# EAGLE design DarkESC (EAGLE 9.0.0)

## Sheet 1 of 6
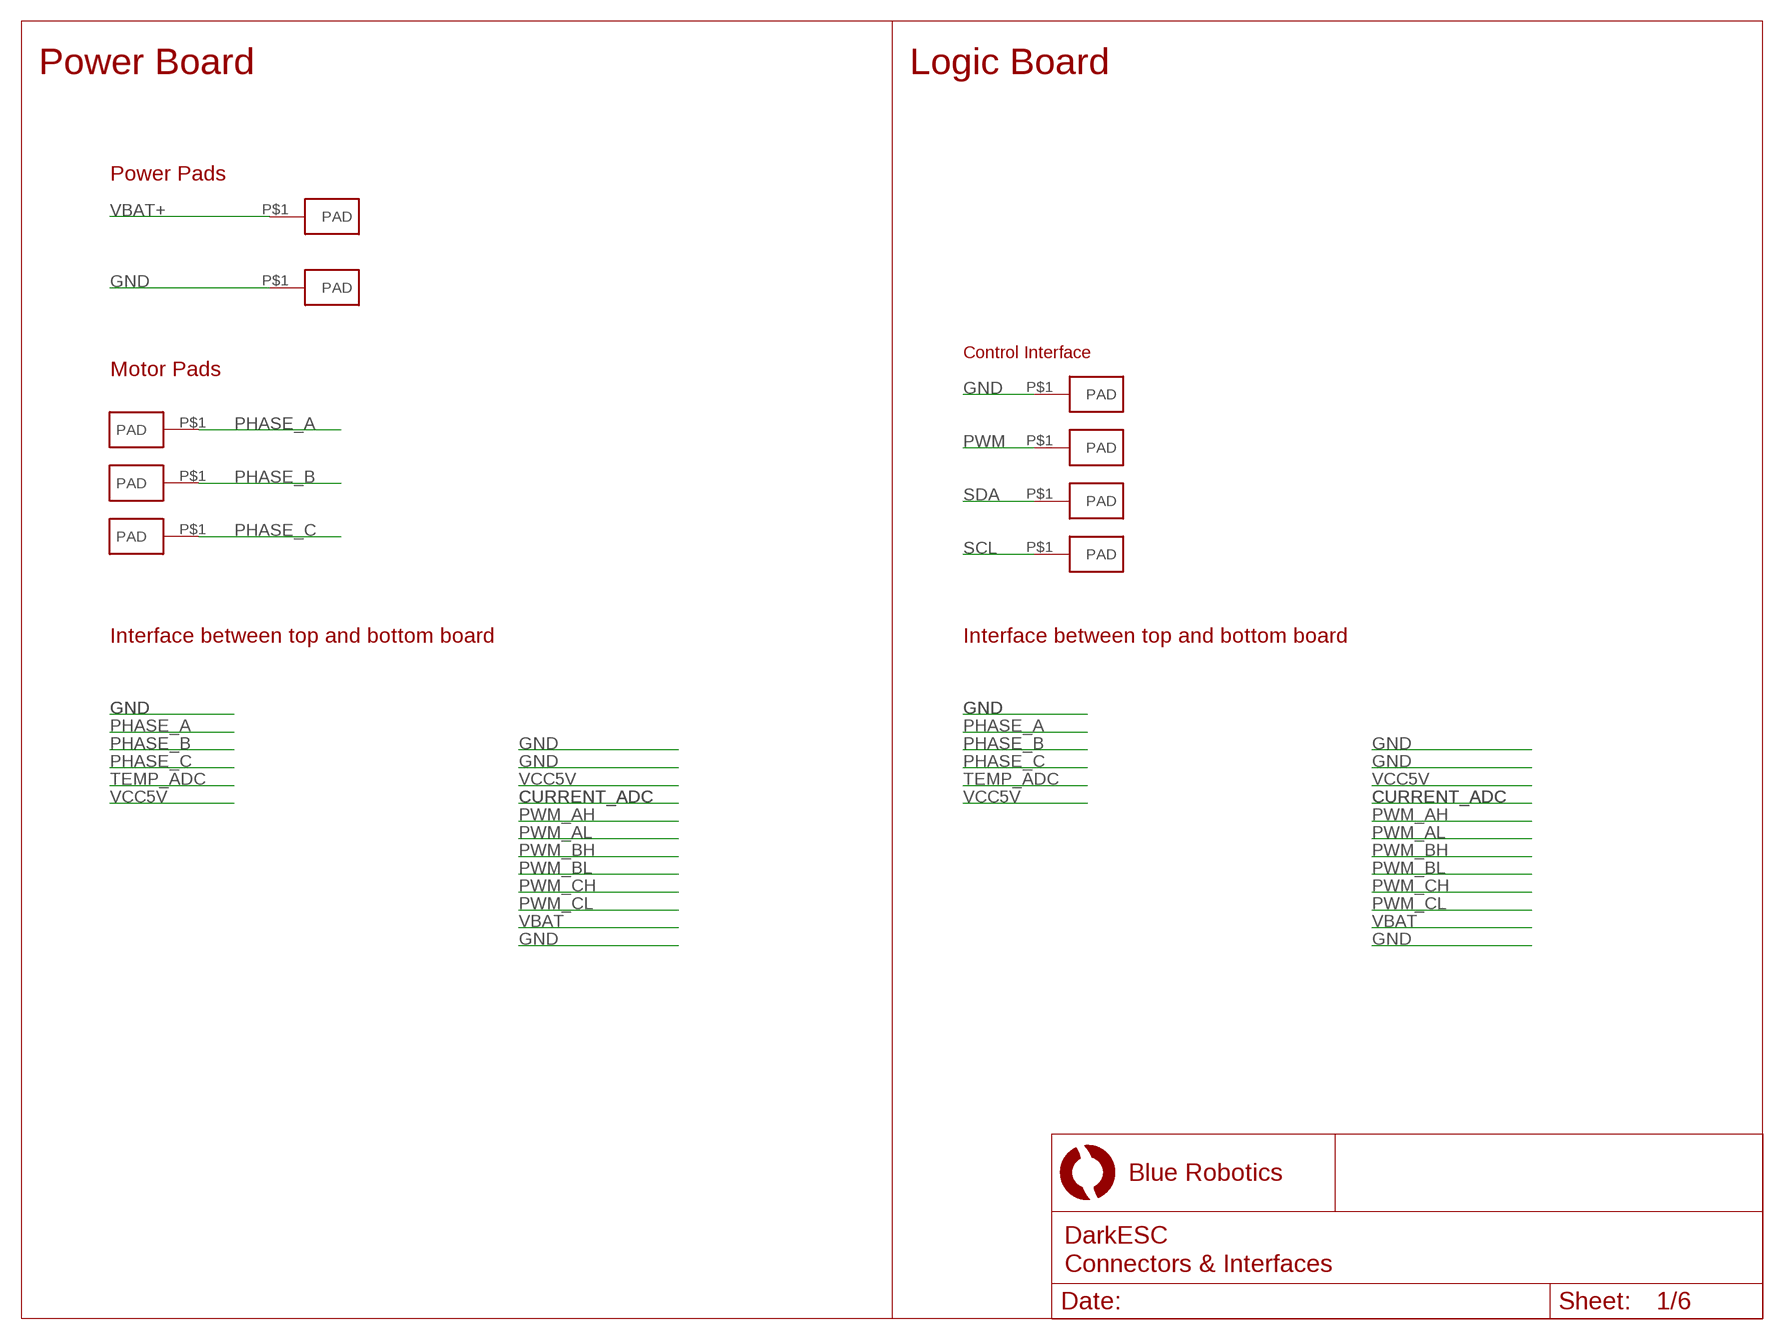
[diagram p0: schematic, sheet 1]

### Parts
U$1  PADPTH-MED  [PAD-PTH-MED-1]
U$2  PADPTH-MED  [PAD-PTH-MED-1]
U$5  PAD18AWG  [PAD-PTH-18AWG-1]
U$6  PAD18AWG  [PAD-PTH-18AWG-1]
U$7  PAD18AWG  [PAD-PTH-18AWG-1]
U$11  PAD1.5X3MM  [PAD-1.5X3MM]
U$12  PAD1.5X3MM  [PAD-1.5X3MM]
U$13  PAD1.5X3MM  [PAD-1.5X3MM]
U$14  PAD1.5X3MM  [PAD-1.5X3MM]

### Nets
GND: U$2.P$1(PAD) U$11.P$1(PAD) ; also sheet 2,3,4,5,6
PHASE_A [HV]: U$5.P$1(PAD) ; also sheet 5,6
PHASE_B [HV]: U$6.P$1(PAD) ; also sheet 5,6
PHASE_C [HV]: U$7.P$1(PAD) ; also sheet 5,6
PWM: U$14.P$1(PAD) ; also sheet 2
SCL: U$13.P$1(PAD) ; also sheet 2
SDA: U$12.P$1(PAD) ; also sheet 2
VBAT+ [HV]: U$1.P$1(PAD) ; also sheet 3,4

### Notes on the sheet
- Power Board | Logic Board
- Power Pads
- Control Interface
- Motor Pads
- Interface between top and bottom board | Interface between top and bottom board

## Sheet 2 of 6
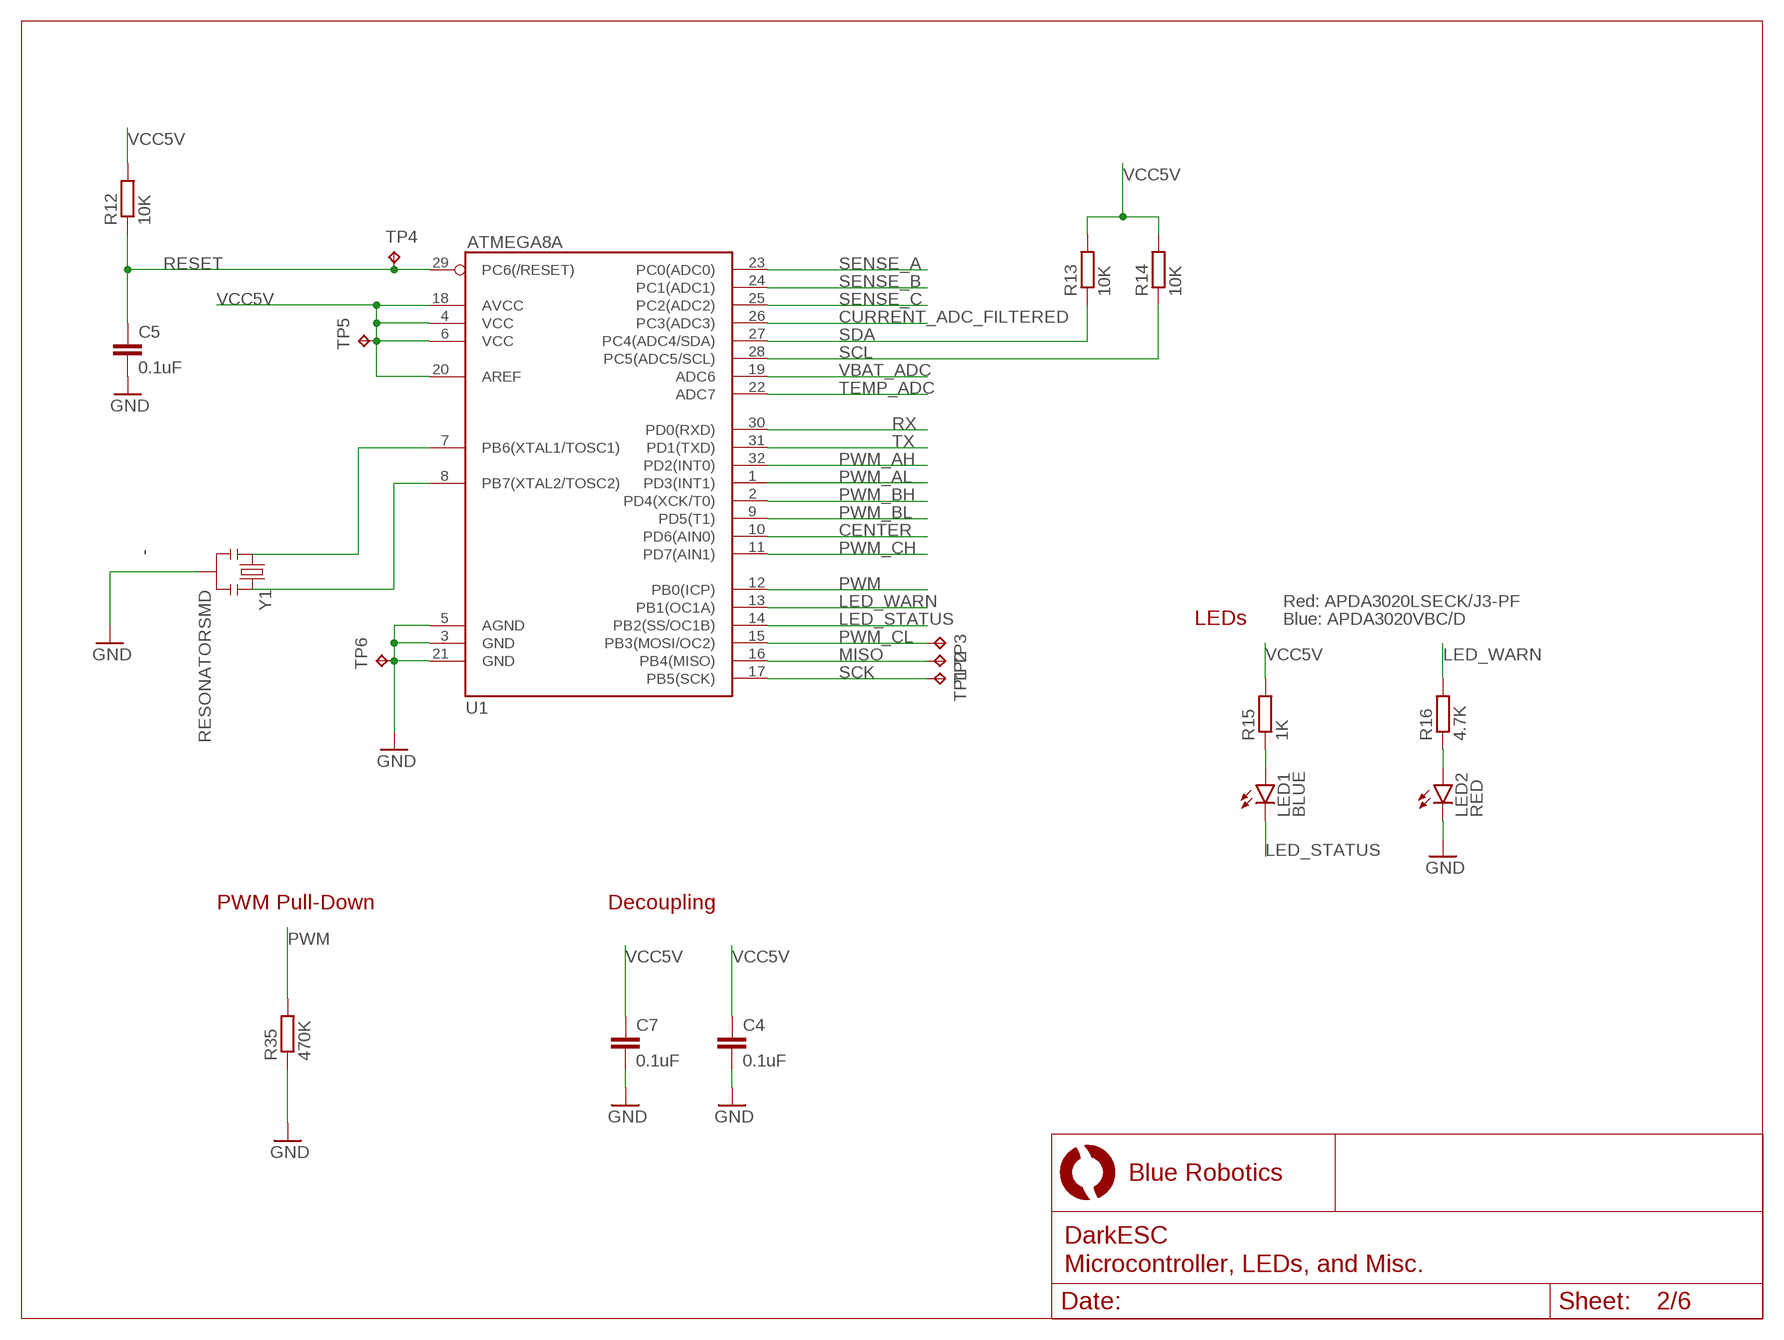
[diagram p1: schematic, sheet 2]

### Parts
C4  0.1uF  C-EUC3216  [C3216]
C5  0.1uF  C-EUC3216  [C3216]
C7  0.1uF  C-EUC3216  [C3216]
LED1  BLUE  LED3X2-RA  [SMT-LED-3X2-RA]
LED2  RED  LED3X2-RA  [SMT-LED-3X2-RA]
R12  10K  R-EU_R3216  [R3216]
R13  10K  R-EU_R3216  [R3216]
R14  10K  R-EU_R3216  [R3216]
R15  1K  R-EU_R3216  [R3216]
R16  4.7K  R-EU_R3216  [R3216]
R35  470K  R-EU_R3216  [R3216]
TP1  TPB1,27  [B1,27]
TP2  TPB1,27  [B1,27]
TP3  TPB1,27  [B1,27]
TP4  TPB1,27  [B1,27]
TP5  TPB1,27  [B1,27]
TP6  TPB1,27  [B1,27]
U1  ATMEGA168  [TQFP32-08]
Y1  RESONATORSMD  [RESONATOR-SMD]

### Nets
CENTER: U1.10(PD6(AIN0)) ; also sheet 5
CURRENT_ADC_FILTERED: U1.26(PC3(ADC3)) ; also sheet 3
GND: C4.2 C5.2 C7.2 LED2.2(C) R35.1 TP6.TP U1.3(GND) U1.5(AGND) U1.21(GND) Y1.2 ; also sheet 1,3,4,5,6
LED_STATUS: LED1.2(C) U1.14(PB2(SS/OC1B))
LED_WARN: R16.2 U1.13(PB1(OC1A))
MISO: TP2.TP U1.16(PB4(MISO))
N$3: LED2.1(A) R16.1
N$10: U1.7(PB6(XTAL1/TOSC1)) Y1.1
N$11: U1.8(PB7(XTAL2/TOSC2)) Y1.3
N$16: LED1.1(A) R15.1
PWM: R35.2 U1.12(PB0(ICP)) ; also sheet 1
PWM_AH: U1.32(PD2(INT0)) ; also sheet 1,6
PWM_AL: U1.1(PD3(INT1)) ; also sheet 1,6
PWM_BH: U1.2(PD4(XCK/T0)) ; also sheet 1,6
PWM_BL: U1.9(PD5(T1)) ; also sheet 1,6
PWM_CH: U1.11(PD7(AIN1)) ; also sheet 1,6
PWM_CL: TP3.TP U1.15(PB3(MOSI/OC2)) ; also sheet 1,6
RESET: C5.1 R12.1 TP4.TP U1.29(PC6(/RESET))
RX: U1.30(PD0(RXD))
SCK: TP1.TP U1.17(PB5(SCK))
SCL: R14.1 U1.28(PC5(ADC5/SCL)) ; also sheet 1
SDA: R13.1 U1.27(PC4(ADC4/SDA)) ; also sheet 1
SENSE_A: U1.23(PC0(ADC0)) ; also sheet 5
SENSE_B: U1.24(PC1(ADC1)) ; also sheet 5
SENSE_C: U1.25(PC2(ADC2)) ; also sheet 5
TEMP_ADC: U1.22(ADC7) ; also sheet 1,3
TX: U1.31(PD1(TXD))
VBAT_ADC: U1.19(ADC6) ; also sheet 3
VCC5V: C4.1 C7.1 R12.2 R13.2 R14.2 R15.2 TP5.TP U1.4(VCC) U1.6(VCC) U1.18(AVCC) U1.20(AREF) ; also sheet 1,3,4

### Notes on the sheet
- ATMEGA8A
- Red: APDA3020LSECK/J3-PF
- LEDs | Blue: APDA3020VBC/D
- PWM Pull-Down | Decoupling

## Sheet 3 of 6
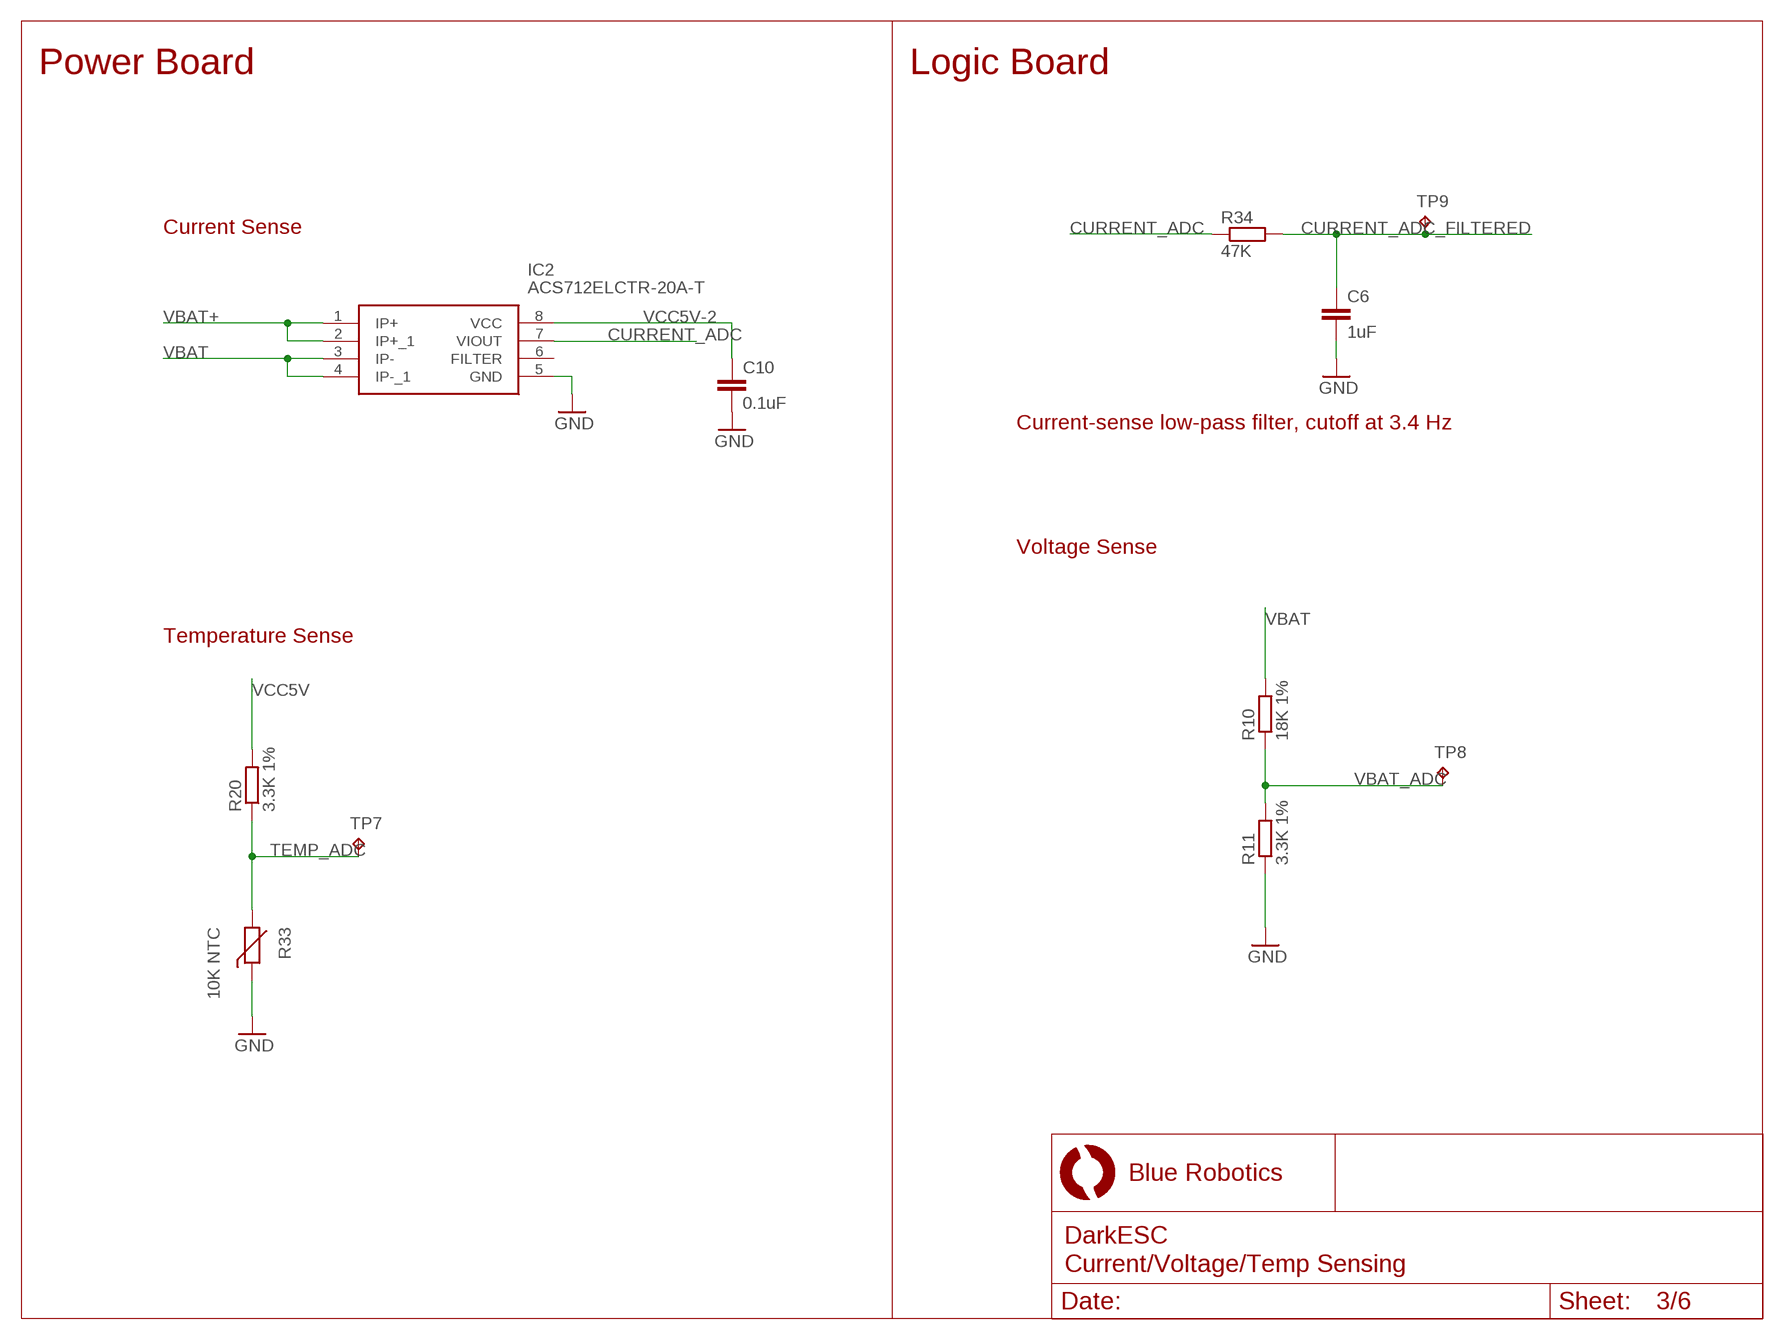
[diagram p2: schematic, sheet 3]

### Parts
C6  1uF  C-EUC3216  [C3216]
C10  0.1uF  C-EUC3216  [C3216]
IC2  ACS712ELCTR-20A-T  [SOIC127P600X175-8N]
R10  18K 1%  R-EU_0204/7  [0204/7]
R11  3.3K 1%  R-EU_0204/7  [0204/7]
R20  3.3K 1%  R-EU_0204/7  [0204/7]
R33  10K NTC  THERMISTOR-2,5  [RS-2,5]
R34  47K  R-EU_R3216  [R3216]
TP7  TPB1,27  [B1,27]
TP8  TPB1,27  [B1,27]
TP9  TPB1,27  [B1,27]

### Nets
CURRENT_ADC: IC2.7(VIOUT) R34.1 ; also sheet 1
CURRENT_ADC_FILTERED: C6.1 R34.2 TP9.TP ; also sheet 2
GND: C6.2 C10.2 IC2.5(GND) R11.1 R33.1 ; also sheet 1,2,4,5,6
TEMP_ADC: R20.1 R33.2 TP7.TP ; also sheet 1,2
VBAT [HV]: IC2.3(IP-) IC2.4(IP-_1) R10.2 ; also sheet 1,4,6
VBAT+ [HV]: IC2.1(IP+) IC2.2(IP+_1) ; also sheet 1,4
VBAT_ADC: R10.1 R11.2 TP8.TP ; also sheet 2
VCC5V: R20.2 ; also sheet 1,2,4
VCC5V-2: C10.1 IC2.8(VCC)
Unconnected: IC2.6(FILTER)

### Notes on the sheet
- Power Board | Logic Board
- Current Sense
- Current-sense low-pass filter, cutoff at 3.4 Hz
- Voltage Sense
- Temperature Sense

## Sheet 4 of 6
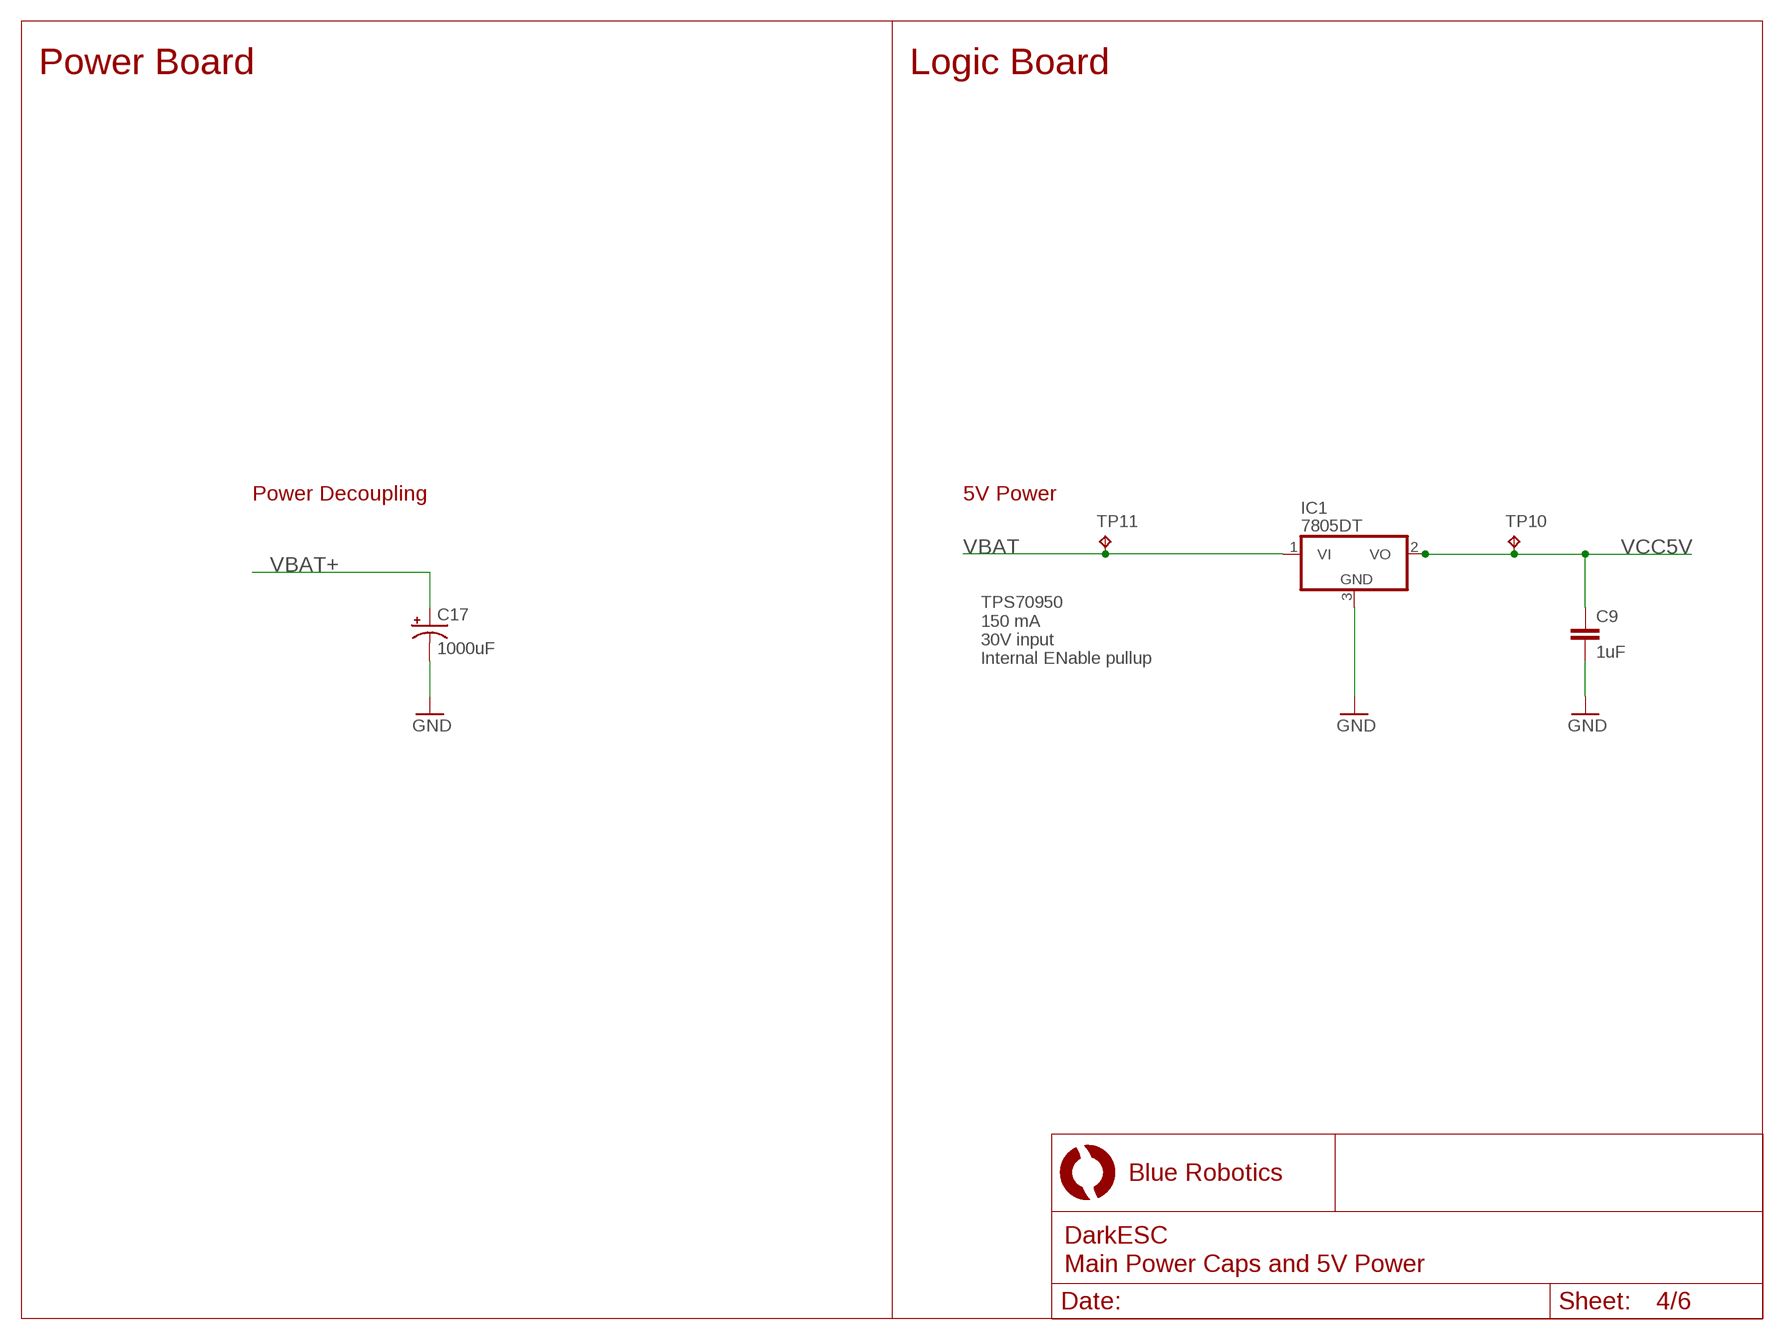
[diagram p3: schematic, sheet 4]

### Parts
C9  1uF  C-EUC3216  [C3216]
C17  1000uF  CAP_POLPTH1  [CPOL-RADIAL-100UF-25V]
IC1  7805DT  [TO252]
TP10  TPB1,27  [B1,27]
TP11  TPB1,27  [B1,27]

### Nets
GND: C9.2 C17.2(-) IC1.3(GND) ; also sheet 1,2,3,5,6
VBAT [HV]: IC1.1(VI) TP11.TP ; also sheet 1,3,6
VBAT+ [HV]: C17.1(+) ; also sheet 1,3
VCC5V: C9.1 IC1.2(VO) TP10.TP ; also sheet 1,2,3

### Notes on the sheet
- Power Board | Logic Board
- Power Decoupling | 5V Power
- TPS70950
  150 mA
  30V input
  Internal ENable pullup

## Sheet 5 of 6
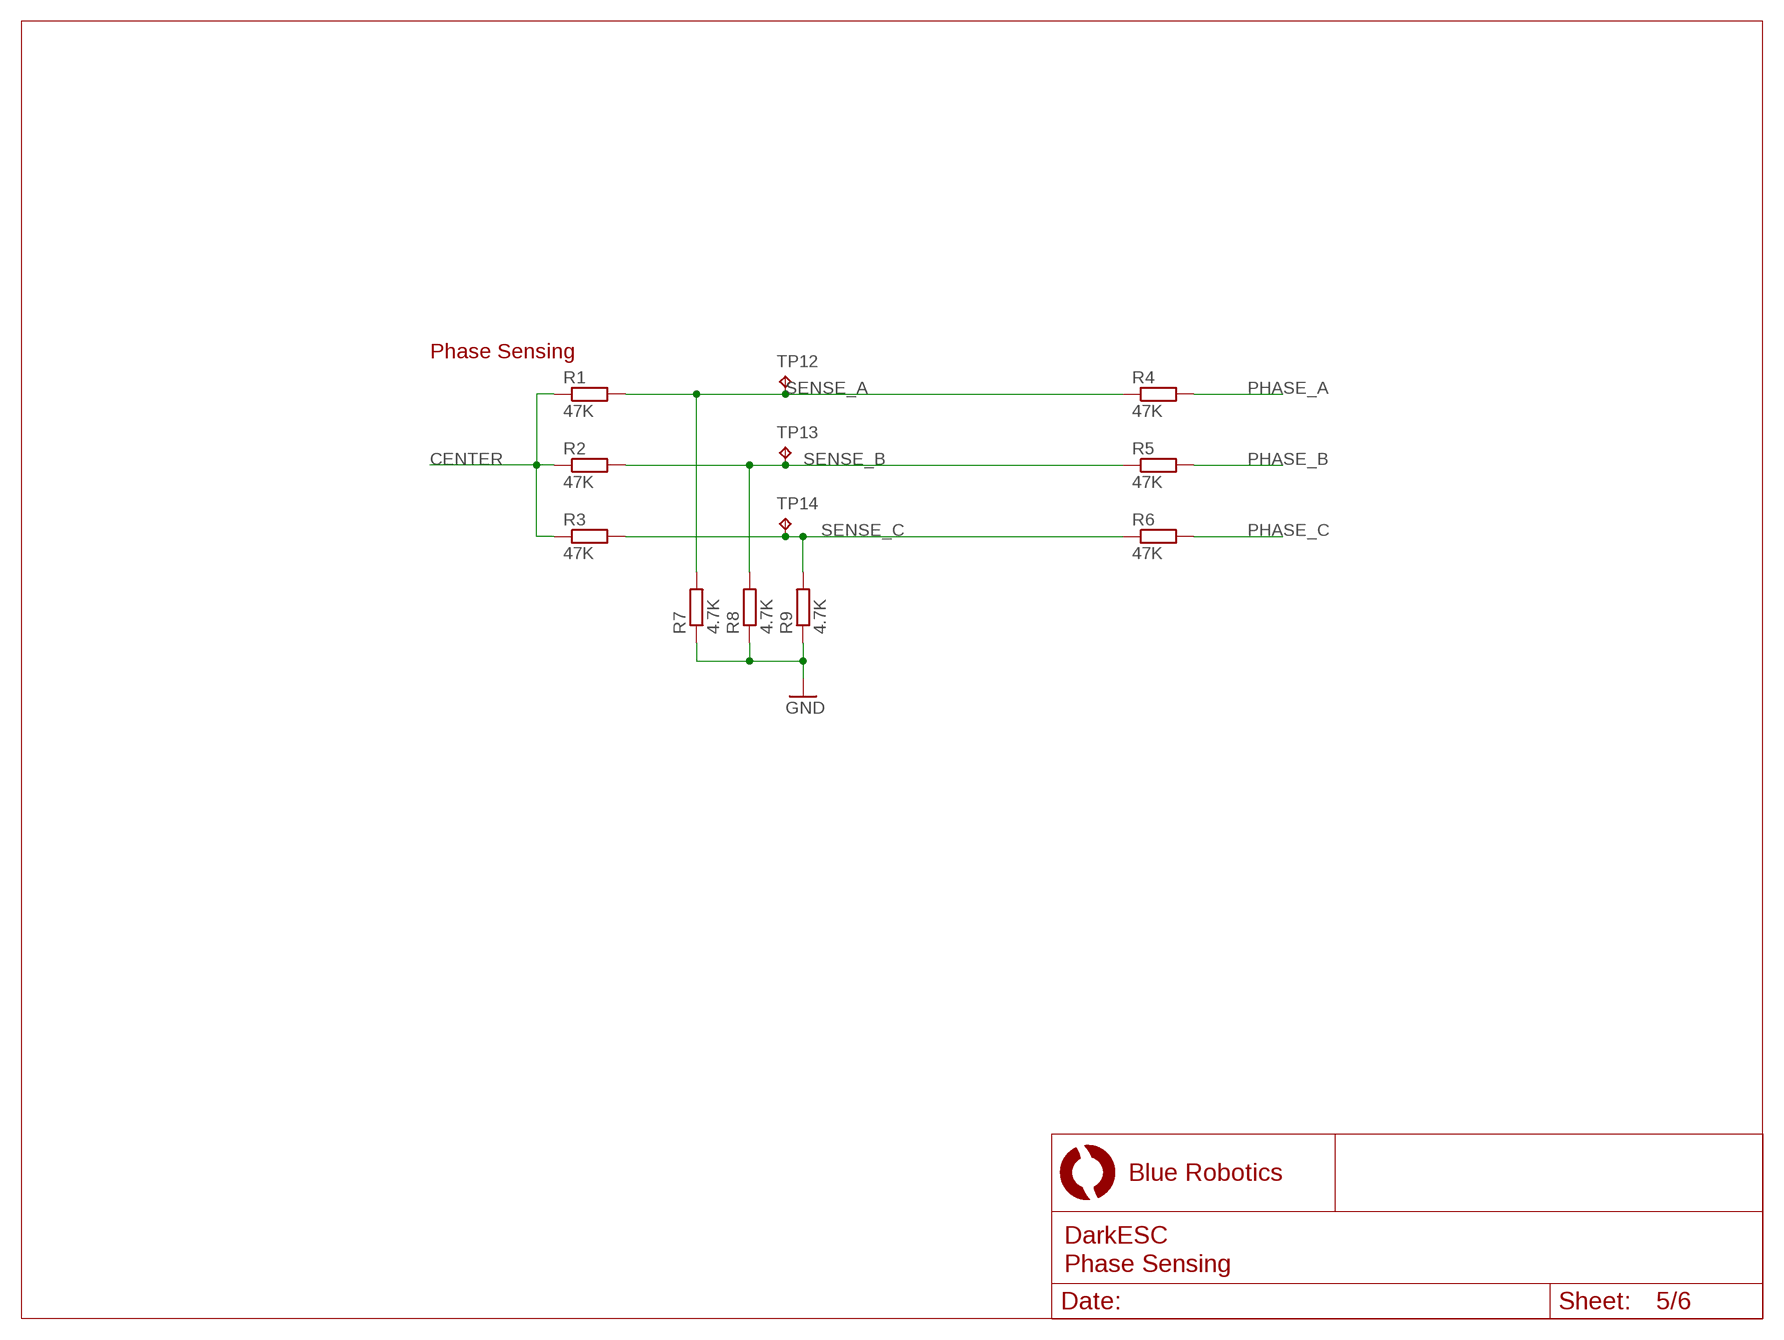
[diagram p4: schematic, sheet 5]

### Parts
R1  47K  R-EU_R3216  [R3216]
R2  47K  R-EU_R3216  [R3216]
R3  47K  R-EU_R3216  [R3216]
R4  47K  R-EU_R3216  [R3216]
R5  47K  R-EU_R3216  [R3216]
R6  47K  R-EU_R3216  [R3216]
R7  4.7K  R-EU_R3216  [R3216]
R8  4.7K  R-EU_R3216  [R3216]
R9  4.7K  R-EU_R3216  [R3216]
TP12  TPB1,27  [B1,27]
TP13  TPB1,27  [B1,27]
TP14  TPB1,27  [B1,27]

### Nets
CENTER: R1.1 R2.1 R3.1 ; also sheet 2
GND: R7.1 R8.1 R9.1 ; also sheet 1,2,3,4,6
PHASE_A [HV]: R4.2 ; also sheet 1,6
PHASE_B [HV]: R5.2 ; also sheet 1,6
PHASE_C [HV]: R6.2 ; also sheet 1,6
SENSE_A: R1.2 R4.1 R7.2 TP12.TP ; also sheet 2
SENSE_B: R2.2 R5.1 R8.2 TP13.TP ; also sheet 2
SENSE_C: R3.2 R6.1 R9.2 TP14.TP ; also sheet 2

### Notes on the sheet
- Phase Sensing

## Sheet 6 of 6
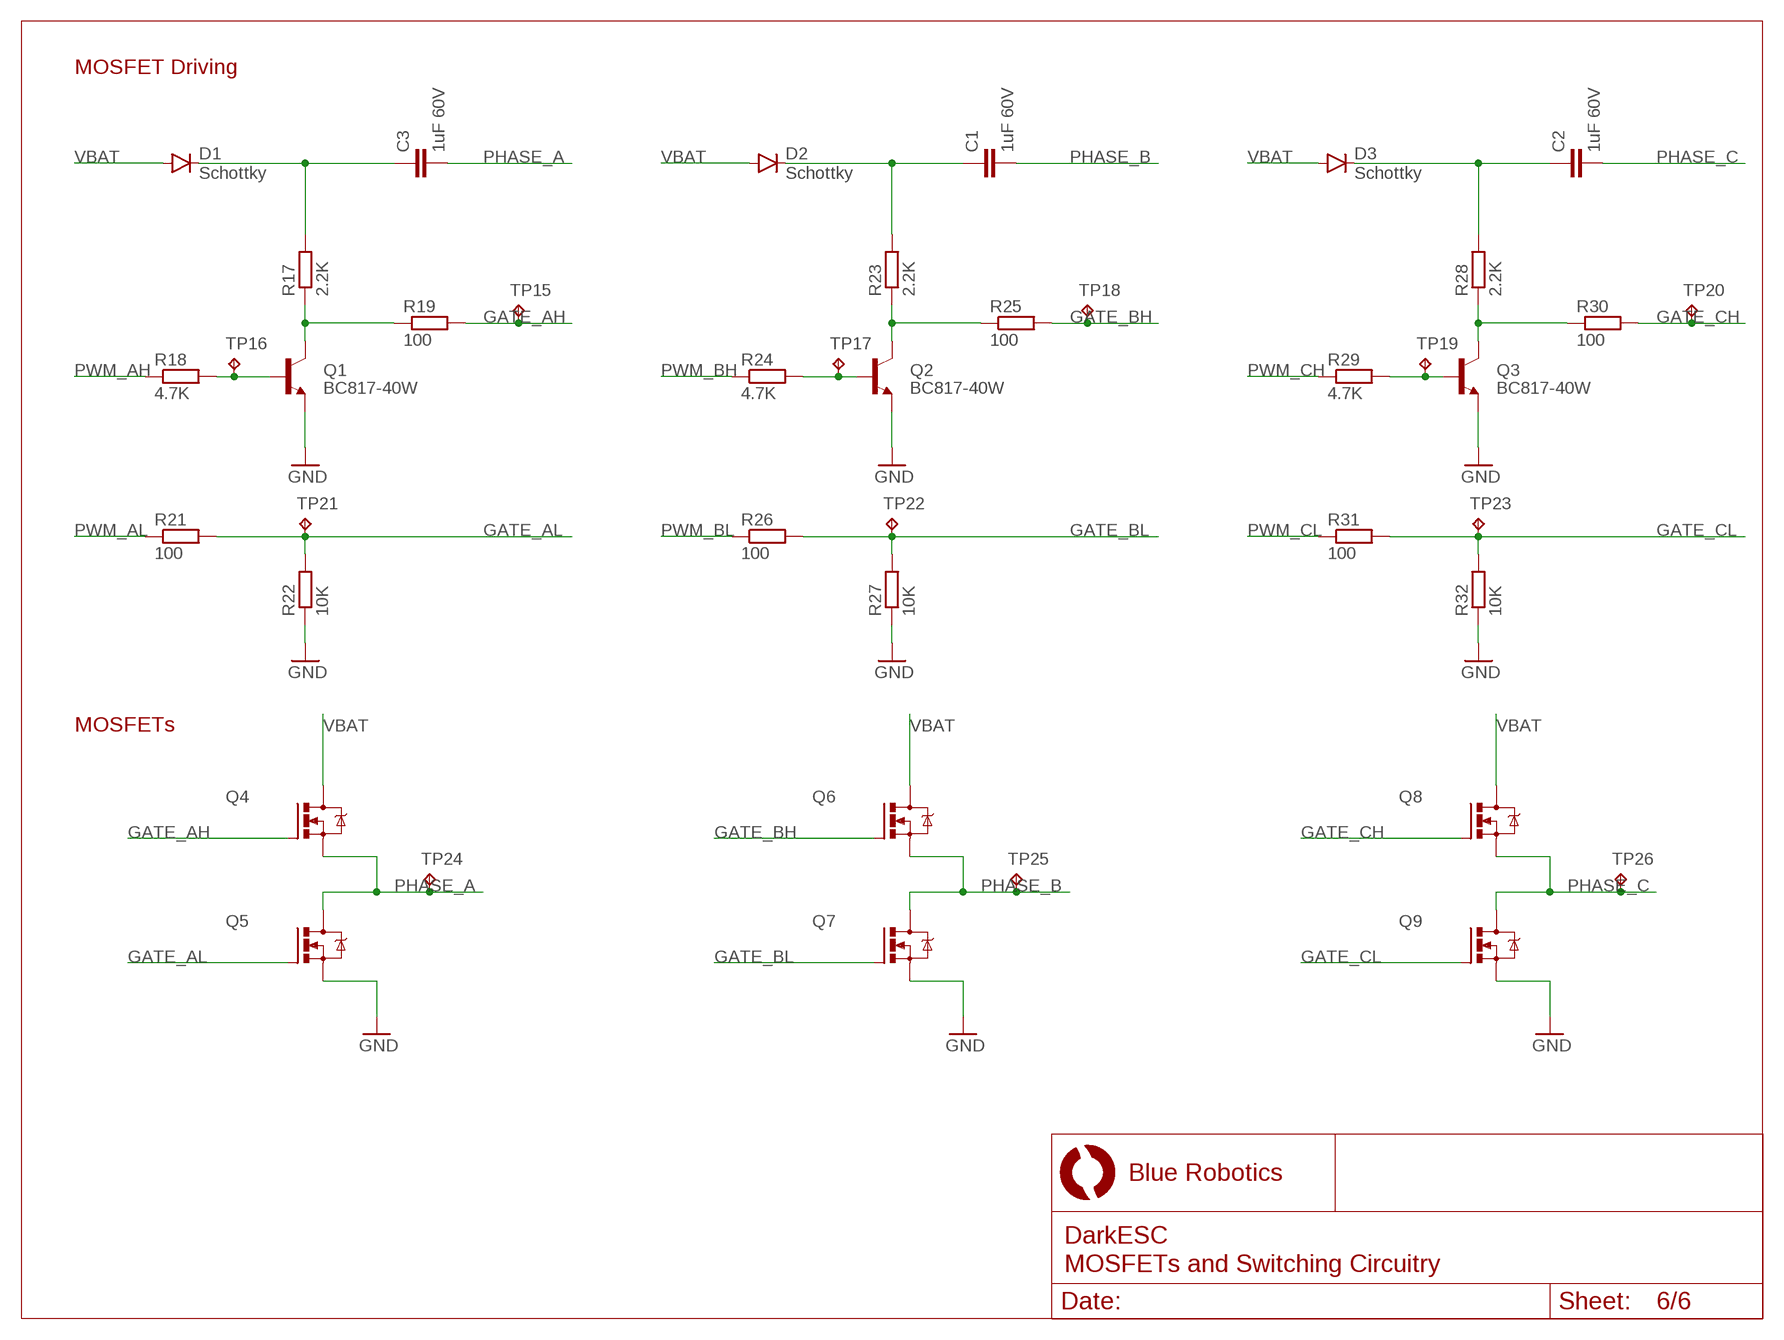
[diagram p5: schematic, sheet 6]

### Parts
C1  1uF 60V  C-EUC3216  [C3216]
C2  1uF 60V  C-EUC3216  [C3216]
C3  1uF 60V  C-EUC3216  [C3216]
D1  Schottky  DIODESMB  [SMB-DIODE]
D2  Schottky  DIODESMB  [SMB-DIODE]
D3  Schottky  DIODESMB  [SMB-DIODE]
Q1  BC817-40W  TRANSISTOR_NPNSOT23  [SOT23]
Q2  BC817-40W  TRANSISTOR_NPNSOT23  [SOT23]
Q3  BC817-40W  TRANSISTOR_NPNSOT23  [SOT23]
Q4  IRF520  [TO220BV]
Q5  IRF520  [TO220BV]
Q6  IRF520  [TO220BV]
Q7  IRF520  [TO220BV]
Q8  IRF520  [TO220BV]
Q9  IRF520  [TO220BV]
R17  2.2K  R-EU_R3216  [R3216]
R18  4.7K  R-EU_R3216  [R3216]
R19  100  R-EU_R3216  [R3216]
R21  100  R-EU_R3216  [R3216]
R22  10K  R-EU_R3216  [R3216]
R23  2.2K  R-EU_R3216  [R3216]
R24  4.7K  R-EU_R3216  [R3216]
R25  100  R-EU_R3216  [R3216]
R26  100  R-EU_R3216  [R3216]
R27  10K  R-EU_R3216  [R3216]
R28  2.2K  R-EU_R3216  [R3216]
R29  4.7K  R-EU_R3216  [R3216]
R30  100  R-EU_R3216  [R3216]
R31  100  R-EU_R3216  [R3216]
R32  10K  R-EU_R3216  [R3216]
TP15  TPB1,27  [B1,27]
TP16  TPB1,27  [B1,27]
TP17  TPB1,27  [B1,27]
TP18  TPB1,27  [B1,27]
TP19  TPB1,27  [B1,27]
TP20  TPB1,27  [B1,27]
TP21  TPB1,27  [B1,27]
TP22  TPB1,27  [B1,27]
TP23  TPB1,27  [B1,27]
TP24  TPB1,27  [B1,27]
TP25  TPB1,27  [B1,27]
TP26  TPB1,27  [B1,27]

### Nets
GATE_AH: Q4.G R19.2 TP15.TP
GATE_AL: Q5.G R21.2 R22.2 TP21.TP
GATE_BH: Q6.G R25.2 TP18.TP
GATE_BL: Q7.G R26.2 R27.2 TP22.TP
GATE_CH: Q8.G R30.2 TP20.TP
GATE_CL: Q9.G R31.2 R32.2 TP23.TP
GND: Q1.2(E) Q2.2(E) Q3.2(E) Q5.S Q7.S Q9.S R22.1 R27.1 R32.1 ; also sheet 1,2,3,4,5
N$2: Q1.1(B) R18.2 TP16.TP
N$4: Q1.3(C) R17.1 R19.1
N$5: Q2.1(B) R24.2 TP17.TP
N$6: Q2.3(C) R23.1 R25.1
N$7: Q3.1(B) R29.2 TP19.TP
N$9: Q3.3(C) R28.1 R30.1
N$12: C3.1 D1.C R17.2
N$15: C1.1 D2.C R23.2
N$19: C2.1 D3.C R28.2
PHASE_A [HV]: C3.2 Q4.S Q5.D TP24.TP ; also sheet 1,5
PHASE_B [HV]: C1.2 Q6.S Q7.D TP25.TP ; also sheet 1,5
PHASE_C [HV]: C2.2 Q8.S Q9.D TP26.TP ; also sheet 1,5
PWM_AH: R18.1 ; also sheet 1,2
PWM_AL: R21.1 ; also sheet 1,2
PWM_BH: R24.1 ; also sheet 1,2
PWM_BL: R26.1 ; also sheet 1,2
PWM_CH: R29.1 ; also sheet 1,2
PWM_CL: R31.1 ; also sheet 1,2
VBAT [HV]: D1.A D2.A D3.A Q4.D Q6.D Q8.D ; also sheet 1,3,4

### Notes on the sheet
- MOSFET Driving
- MOSFETs

## Library data of the parts
C1-C7 C9 C10 = rcl:C-EU: CAPACITOR, European symbol; SPICEPREFIX: C
C17 = SparkFun-Capacitors:CAP_POL: Capacitor Polarized These are standard SMD and PTH capacitors. Normally 10uF, 47uF, and 100uF in electrolytic and tantalum varieties. Always verify the external diameter of the through hole cap, it varies with capacity, voltage, and manufacturer. The EIA devices should be standard.
D1-D3 = SparkFun-DiscreteSemi:DIODE: Diode These are standard reverse protection diodes and small signal diodes. SMA package can handle up to about 1A. SOD-323 can handle about 200mA. What the SOD-323 package when ordering, there are some mfgs out there that are 5-pin packages.; PROD_ID: DIO-09646
IC1 = linear:78*: Positive VOLTAGE REGULATOR Source: http://cache.national.com/ds/LM/LM78L05.pdf http://www.fairchildsemi.com/ds/LM/LM7805.pdf
IC2 = SamacSys_Parts:ACS712ELCTR-20A-T: ACS712ELCTR-20A-T, Hall Effect Sensor 5V 8-Pin SOIC, SOIC N Source: Datasheet <http://docs-europe.electrocomponents.com/webdocs/0d88/0900766b80d885f5.pdf>; ALLIED_NUMBER: R1076682; ALLIED_PRICE/STOCK: http://www.alliedelec.com/allegro-microsystems-acs712elctr-20a-t/R1076682/; ARROW_PART_NUMBER: ACS712ELCTR-20A-T; ARROW_PRICE/STOCK: https://www.arrow.com/en/products/acs712elctr-20a-t/allegro-microsystems; DESCRIPTION: ACS712ELCTR-20A-T, Hall Effect Sensor 5V 8-Pin SOIC, SOIC N; HEIGHT: 1.75mm; MANUFACTURER_NAME: Allegro Microsystems; MANUFACTURER_PART_NUMBER: ACS712ELCTR-20A-T; RS_PART_NUMBER: 1729271; RS_PRICE/STOCK: http://uk.rs-online.com/web/p/products/1729271
LED1 LED2 = BR-Eagle-Library:LED: LEDs Standard schematic elements and footprints for 5mm, 3mm, 1206, and 0603 sized LEDs. 5mm - Spark Fun Electronics SKU : COM-00529 (and others)
Q1-Q3 = SparkFun-DiscreteSemi:TRANSISTOR_NPN: Generic NPN BJT MMBT2222A - TRANS-08049 (SOT-23, 1A 40V) MPSA42 - TRANS-09116 (SOT-23, 500mA 300V) MMBT5088LT1G - TRANS-11160 (SOT-23, 50 mA 30V) BC547 - COM-08928 <http://www.sparkfun.com/products/8928> (TO-92 45V 100mA) (1.Collector 2.Base 3.Emitter) 2N3904 - COM-00521 <http://www.sparkfun.com/products/521> (TO-92 40V 200mA) (1.Emitter 2.Base 3.Collector) P2N2222A - COM-12852 <http://www.sparkfun.com/products/12852> (TO-92 40V 600mA) (1.Collector 2.Base 3.Emitter)
Q4-Q9 = transistor-power:IRF520: HEXFET Power MOSFET
R1-R32 R34 R35 = resistor:R-EU_: RESISTOR, European symbol
R33 = varistor:THERMISTOR: THERMISTOR
TP1-TP26 = testpad:TP: Test pad
U1 = SparkFun-DigitalIC:ATMEGA168: Atmel 32-pin 8-bit micro, 16k flash.
U$1 U$2 U$5-U$7 U$11-U$14 = BR-Eagle-Library:PAD
Y1 = SparkFun:RESONATOR: Resonator Small SMD resonator. This is the itty bitty 10/20MHz resonators with built in caps. CSTCE10M0G55 and CSTCE20M0V53. Footprint has been reviewed closely but hasn't been tested yet.

## Net classes
1 HV: width 0.635 mm

## Board
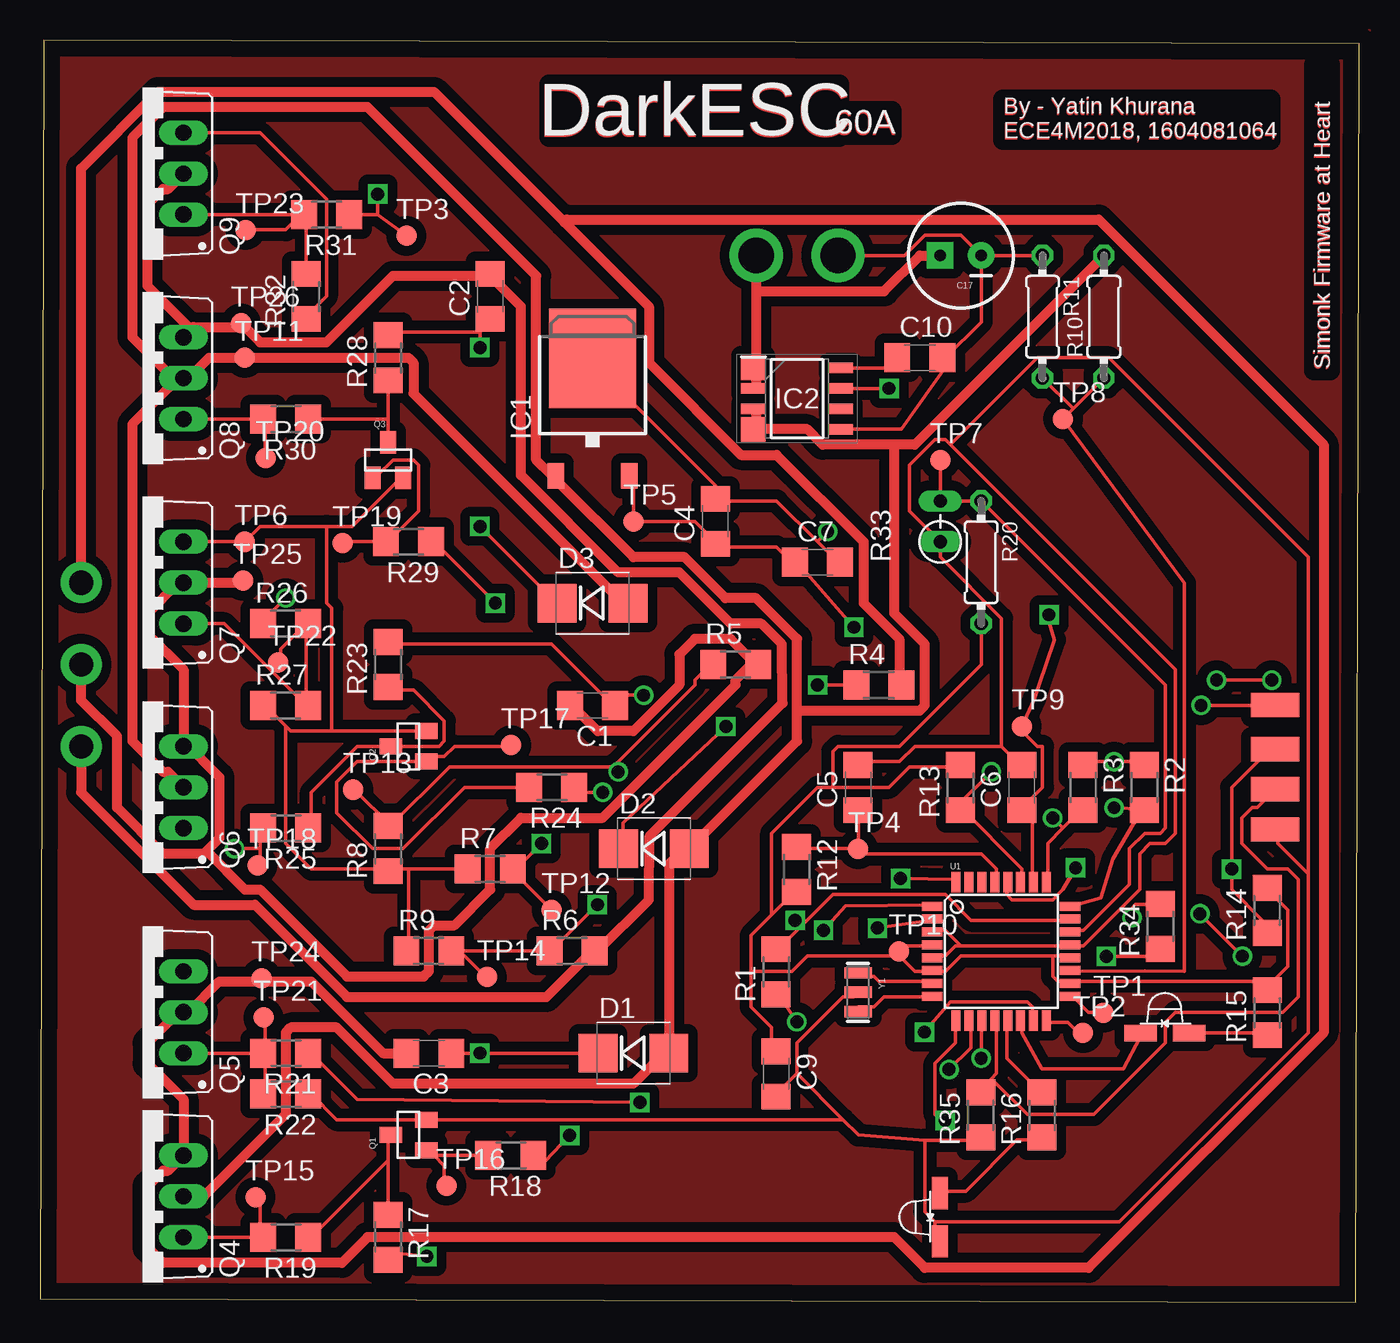
[diagram p6: board, top side]
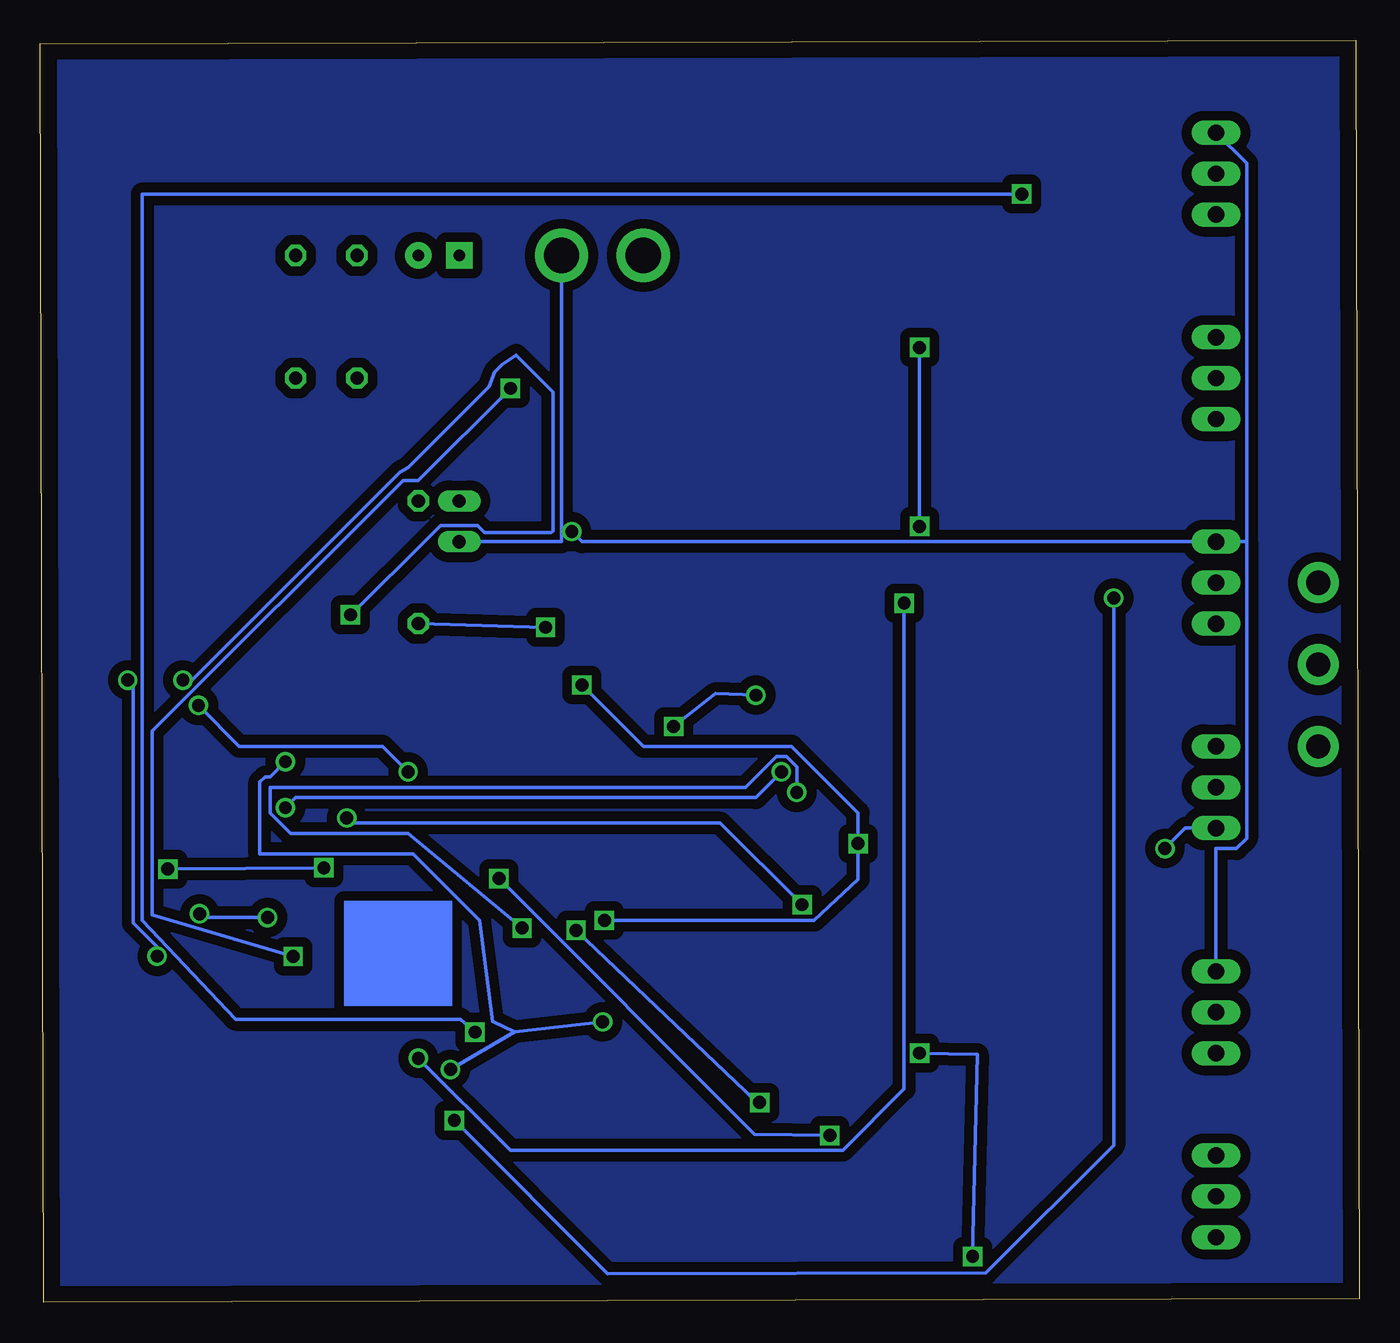
[diagram p7: board, bottom side, seen from below]

Size 81.89 x 78.36 mm. Coordinates in mm from the lower left corner, seen from the top.
Outline: 0,0.23 81.67,0 81.89,78.13 0.23,78.36 0,0.23
Copper layers (1*16): Top 0.035mm / dielectric 1.5mm / Bottom 0.035mm
Design rules "default *": minimum track width 8mil, minimum drill 0.8mm, track to track 10mil, track to pad 10mil, pad to pad 6mil, via to via 6mil, smd to smd 6mil, copper to edge 40mil, drill to drill 6mil, minimum pad ring 10mil, minimum via ring 8mil, stop-mask expansion 4mil, vias tented up to drill 0mil, thermal gap 10mil

### Footprints (pad centres in the part's own frame; a part is rotated, then mirrored left to right if it is on the bottom)
C3216 = smd 1.6 x 1.8: 1 -1.4,0; 2 1.4,0
CPOL-RADIAL-100UF-25V = drill 0.7 pad 1.651 square: 1 1.27,0 | drill 0.7 pad 1.651: 2 -1.27,0
SMB-DIODE = smd 2.4 x 2.4: A 2.2,0; C -2.2,0
TO252 = smd 1 x 1.6: 1 -2.28,-4.8; 2 2.28,-4.8 | smd 5.4 x 6.2: 3 0,2.5
SOIC127P600X175-8N = smd 1.525 x 1.524: 1 -2.712,1.905; 4 -2.712,-1.905 | smd 1.525 x 0.65: 2 -2.712,0.635; 3 -2.712,-0.635; 5 2.712,-1.905; 6 2.712,-0.635; 7 2.712,0.635; 8 2.712,1.905
SMT-LED-3X2-RA = smd 2 x 1: 1 1.5,0; 2 -1.5,0
SOT23 = smd 1 x 1.4: 1 -0.95,-1.1; 2 0.95,-1.1; 3 0,1.1
TO220BV = drill 1.016 long: D 0,-2.54; G -2.54,-2.54; S 2.54,-2.54
R3216 = smd 1.6 x 1.8: 1 -1.4,0; 2 1.4,0
0204/7 = drill 0.813 octagon: 1 -3.81,0; 2 3.81,0
RS-2,5 = drill 0.813 long: 1 -1.27,0; 2 1.27,0
B1,27 = smd 1.27 x 1.27: TP 0,0
TQFP32-08 = smd 1.27 x 0.559: 1 -4.293,2.8; 2 -4.293,2; 3 -4.293,1.2; 4 -4.293,0.4; 5 -4.293,-0.4; 6 -4.293,-1.2; 7 -4.293,-2; 8 -4.293,-2.8; 17 4.293,-2.8; 18 4.293,-2; 19 4.293,-1.2; 20 4.293,-0.4; 21 4.293,0.4; 22 4.293,1.2; 23 4.293,2; 24 4.293,2.8 | smd 0.559 x 1.27: 9 -2.8,-4.293; 10 -2,-4.293; 11 -1.2,-4.293; 12 -0.4,-4.293; 13 0.4,-4.293; 14 1.2,-4.293; 15 2,-4.293; 16 2.8,-4.293; 25 2.8,4.293; 26 2,4.293; 27 1.2,4.293; 28 0.4,4.293; 29 -0.4,4.293; 30 -1.2,4.293; 31 -2,4.293; 32 -2.8,4.293
PAD-PTH-MED-1 = drill 2.2 pad 3.302: P$1 0,0
PAD-PTH-18AWG-1 = drill 1.5 pad 2.54: P$1 0,0
PAD-1.5X3MM = smd 3 x 1.5: P$1 0,0
RESONATOR-SMD = smd 0.7 x 1.7: 1 -1.2,0; 2 0,0; 3 1.2,0

### Placement (x,y rotation side)
C1  34.29,37.06 180 top
C2  27.94,62.46 90 top
C3  24.13,15.47 180 top
C4  41.91,48.49 90 top
C5  50.77,31.95 90 top
C6  60.93,31.95 90 top
C7  48.26,45.95 0 top
C9  45.69,14.17 270 top
C10  54.61,58.65 0 top
C17  57.15,65 180 top
D1  36.83,15.47 0 top
D2  38.1,28.17 0 top
D3  34.29,43.41 0 top
IC1  34.29,56.11 0 top
IC2  46.99,56.11 0 top
LED1  69.82,16.71 0 top
LED2  55.85,5.28 90 top
Q1  22.86,10.39 90 top
Q2  22.86,34.52 90 top
Q3  21.59,52.3 0 top
Q4  6.35,6.58 90 top
Q5  6.35,18.01 90 top
Q6  6.35,31.98 90 top
Q7  6.35,44.68 90 top
Q8  6.35,57.38 90 top
Q9  6.35,70.08 90 top
R1  45.69,20.52 90 top
R2  68.55,31.95 270 top
R3  64.74,31.95 270 top
R4  52.07,38.33 0 top
R5  43.18,39.6 0 top
R6  33.02,21.82 0 top
R7  27.94,26.9 0 top
R8  21.59,28.17 90 top
R9  24.13,21.82 0 top
R10  66.04,61.19 90 top
R11  62.23,61.19 270 top
R12  46.96,26.87 270 top
R13  57.12,31.95 90 top
R14  76.17,24.33 90 top
R15  76.17,17.98 90 top
R16  62.2,11.63 90 top
R17  21.59,4.04 270 top
R18  29.21,9.12 180 top
R19  15.24,4.04 180 top
R20  58.42,45.95 270 top
R21  15.24,15.47 180 top
R22  15.24,12.93 180 top
R23  21.59,39.6 90 top
R24  31.75,31.98 180 top
R25  15.24,29.44 180 top
R26  15.24,42.14 0 top
R27  15.24,37.06 0 top
R28  21.59,58.65 90 top
R29  22.86,47.22 180 top
R30  15.24,54.84 180 top
R31  17.78,67.54 180 top
R32  16.51,62.46 90 top
R33  55.88,48.49 90 top
R34  69.55,23.34 90 top
R35  58.39,11.63 90 top
TP1  66.01,17.98 0 top
TP2  64.74,16.71 0 top
TP3  22.73,66.22 0 top
TP4  50.77,28.14 0 top
TP5  36.83,48.49 0 top
TP6  12.7,47.22 0 top
TP7  55.88,52.3 0 top
TP8  63.5,54.84 0 top
TP9  60.93,35.76 0 top
TP10  53.31,21.79 0 top
TP11  12.7,58.65 0 top
TP12  31.75,24.36 0 top
TP13  19.43,31.83 0 top
TP14  27.74,20.19 0 top
TP15  13.36,6.53 0 top
TP16  25.22,7.24 0 top
TP17  29.24,34.59 0 top
TP18  13.49,27.13 0 top
TP19  18.77,47.14 0 top
TP20  14,52.43 0 top
TP21  13.87,17.68 0 top
TP22  14.76,39.73 0 top
TP23  12.75,66.57 0 top
TP24  13.74,20.12 0 top
TP25  12.6,44.81 0 top
TP26  12.47,60.78 0 top
U1  59.66,21.79 0 top
U$1  44.45,65 0 top
U$2  49.53,65 0 top
U$5  2.54,44.68 0 top
U$6  2.54,39.6 0 top
U$7  2.54,34.52 0 top
U$11  76.66,29.36 0 top
U$12  76.66,37.08 0 top
U$13  76.66,34.34 0 top
U$14  76.66,31.85 0 top
Y1  50.77,19.25 270 top

### Tracks (layer width: path | path; a pad name or v marks a point on that pad's centre or on a via)
CENTER  (via drill 0.8)
  Top 0.203: R3.1 64.77,33.57 v66.67,33.57 68.26,33.57 R2.1 | v56.43,14.45 57.78,15.79 57.78,17.37 U1.10 | v46.98,17.41 45.72,19.28 R1.1
  Bottom 0.203: 52.45,16.78 v56.43,14.45 | v46.98,17.41 52.45,16.78 | v66.67,33.57 67.63,32.61 67.94,32.61 68.26,32.3 68.26,27.85 58.74,27.85 54.61,23.72 53.82,17.44 52.45,16.78
CURRENT_ADC  (via drill 0.8)
  Top 0.203: v52.7,56.74 IC2.7 | v66.19,21.48 69.51,21.48 R34.1
  Bottom 0.203: v52.7,56.74 58.42,51.03 59.37,51.03 74.93,35.47 74.93,24.04 v66.19,21.48
CURRENT_ADC_FILTERED  (via drill 0.8)
  Top 0.203: U1.26 61.59,26.26 61.59,29.76 60.96,30.39 C6.1 60.96,30.71 62.23,31.98 62.23,34.52 61.91,34.52 60.96,35.47 TP9.TP 61.73,37.45 61.99,38.29 62.98,41.14 62.61,42.27 v62.64,42.68 | v67.78,23.89 67.78,24.46 68.01,24.69 69.49,24.69 R34.2 | v74.64,21.49 v72.01,24.12 | v73.04,38.63 v76.47,38.63
  Bottom 0.203: v67.78,23.89 71.78,23.89 v72.01,24.12 | v74.64,21.49 74.64,22.06 76.12,23.55 76.12,38.29 v76.47,38.63 | v73.04,38.63 72.47,38.63 59.55,51.55 59.04,51.83 54.01,56.86 53.68,57.76 53.23,58.22 52.35,58.8 50.06,56.51 50.06,47.89 50.18,47.78 54.29,47.78 54.75,48.23 57.04,48.23 57.61,47.66 v62.64,42.68
GATE_AH
  Top 0.203: 13.65,4.04 13.65,6.26 TP15.TP | Q4.G 13.65,4.04 | 13.65,4.04 R19.2
GATE_AL
  Top 0.203: 13.97,15.47 13.97,17.37 TP21.TP | 13.97,15.47 13.97,12.93 R22.2 | 13.97,15.47 R21.2 Q5.G
GATE_BH  (via drill 0.8)
  Top 0.203: 13.65,28.17 13.65,29.44 R25.2 | 13.65,28.17 13.65,27.22 TP18.TP | v12.06,28.17 13.65,28.17
  Bottom 0.203: v12.06,28.17 10.79,29.44 Q6.G
GATE_BL
  Top 0.203: 16.51,42.14 14.92,40.55 14.92,39.92 TP22.TP | 16.51,42.14 16.51,37.06 | 16.51,42.14 R26.2 | Q7.G 11.43,42.14 16.51,37.06 | 16.51,37.06 R27.2
GATE_CH
  Top 0.203: TP20.TP 13.97,52.62 13.97,54.84 R30.2 Q8.G
GATE_CL
  Top 0.203: 16.19,67.54 15.24,66.59 13.02,66.59 TP23.TP | R32.2 16.51,67.54 R31.2 16.19,67.54 | 16.19,67.54 Q9.G
GND  (via drill 0.8)
  Top 0.203: Q7.S TP6.TP 13.65,48.17 17.78,48.17 | 17.78,48.17 19.37,48.17 22.23,51.03 Q3.2 | R7.1 22.86,26.9 | 22.86,26.9 21.59,26.9 | 22.86,26.9 22.86,21.82 R9.1 | 18.1,35.47 15.56,35.47 15.24,35.79 | 18.1,35.47 23.81,35.47 Q2.2 | 15.24,35.79 13.97,37.06 R27.1 | 21.59,26.9 16.83,26.9 15.24,28.49 15.24,35.79 | 21.59,26.9 R8.1 | 17.78,48.17 17.78,43.41 18.1,43.09 18.1,35.47 | 57.15,22.14 63.82,22.14 U1.21 64.14,22.14 64.77,22.14 68.26,25.63 68.26,27.85 68.9,28.49 69.85,28.49 70.48,29.12 70.48,39.28 56.52,53.25 | 57.15,22.14 56.83,22.14 56.2,21.5 55.56,21.5 U1.5 | 57.15,22.14 56.2,23.09 55.56,23.09 U1.3 | 59.69,34.52 54.29,34.52 53.34,33.57 50.8,33.57 C5.2 | 59.69,34.52 60.64,33.57 C6.2 | 59.69,34.52 59.69,42.46 55.88,46.27 R33.1 53.98,49.12 53.98,51.98 55.56,53.57 56.2,53.57 56.52,53.25 | R22.1 16.83,12.93 18.41,11.34 23.81,11.34 Q1.2 24.13,11.34 49.85,11.34 | 46.99,14.2 46.99,16.1 49.85,18.96 50.48,18.96 Y1.2 | 46.99,14.2 45.72,12.93 C9.2 | 54.93,10.06 50.8,10.39 49.85,11.34 | 54.93,10.06 58.1,10.06 R35.1 | 46.99,14.2 49.85,11.34 | 55.56,4.99 55.56,4.04 LED2.2 | 55.56,4.99 54.93,5.63 54.93,10.06 | 78.74,26.58 76.83,28.49 76.83,29.12 U$11.P$1 | 78.74,26.58 78.74,16.74 66.99,4.99 55.56,4.99 | 56.52,53.25 61.91,58.65 66.36,58.65 78.74,46.27 78.74,26.58 | Q9.S 13.65,72.62 17.78,68.49 17.78,62.46 16.51,61.19 R32.1 | 48.26,47.22 49.53,45.95 C7.2 | 48.26,47.22 45.72,49.76 41.91,49.76 C4.2 41.91,50.71 34.29,58.33 IC1.3 | C17.2 R11.1 | IC2.5 53.47,54.2 56.44,58.39 C10.2 56.2,58.65 58.42,60.87 C17.2 | U$2.P$1 53.66,65 54.93,66.27 57.15,66.27 C17.2 | 48.26,47.22 v48.9,47.85
  Bottom 0.203: 49.53,47.85 49.53,47.22 R33.1 | 49.53,47.85 U$2.P$1 | 49.53,47.85 v48.9,47.85 48.26,47.22 Q7.S 6.99,47.22 | Q5.S 8.89,28.17 7.62,28.17 6.99,28.8 6.99,47.22 | Q9.S 6.99,70.71 6.99,47.22
LED_STATUS
  Top 0.203: U1.14 60.96,17.37 60.96,16.74 62.18,14.5 67.26,14.5 68.26,16.42 LED1.2
LED_WARN
  Top 0.203: U1.13 60.01,17.37 60.01,15.15 61.91,13.25 R16.2
MISO
  Top 0.203: U1.16 62.55,17.37 63.82,17.37 64.45,16.74 TP2.TP
N$1
  pour Top (isolate 0.61): 0,77.7 0,0.23 82.55,0.23 82.55,78.97 0,78.97
N$2
  Top 0.203: 24.45,9.12 24.13,9.44 Q1.1 24.45,9.12 | 24.45,9.12 25.08,8.48 25.08,7.53 TP16.TP | 24.45,9.12 R18.2
N$3
  Top 0.203: R16.1 61.91,10.07 60.64,10.07 57.47,6.9 55.88,6.9 LED2.1
N$4
  Top 0.203: R17.1 21.59,8.8 | 21.59,8.8 21.59,10.39 Q1.3 | 21.59,8.8 16.83,4.04 R19.1
N$5
  Top 0.203: TP17.TP 29.21,34.52 25.72,34.52 25.08,33.88 24.13,33.88 Q2.1 23.81,33.57 19.68,33.57 18.41,32.3 18.41,30.39 20.64,28.17 22.54,28.17 26.35,31.98 R24.2
N$6
  Top 0.203: R25.1 16.83,29.44 16.83,31.66 19.68,34.52 Q2.3 24.77,34.52 25.08,34.84 25.08,36.11 23.18,38.01 21.59,38.01 R23.1
N$7
  Top 0.203: TP19.TP 19.05,47.22 R29.2 21.59,47.22 23.5,49.12 23.5,51.98 23.18,52.3 21.91,52.3 20.95,51.35 Q3.1
N$8
  pour Bottom (isolate 0.61): 0,78.97 0,0.23 81.28,0.23 81.28,78.97
N$9
  Top 0.203: R28.1 21.59,54.84 | 21.59,54.84 Q3.3 | 21.59,54.84 R30.1
N$10
  Top 0.203: U1.7 55.24,19.91 52.07,19.91 51.75,20.23 50.8,20.23 Y1.1
N$11
  Top 0.203: U1.8 55.24,18.96 52.39,18.96 51.75,18.33 50.8,18.33 Y1.3
N$12  (via drill 0.8)
  Top 0.203: D1.C v27.3,15.47 C3.1 | v24,2.84 21.54,3.1 R17.2
  Bottom 0.203: v24,2.84 23.72,15.39 v27.3,15.47
N$15  (via drill 0.8)
  Top 0.203: 34.92,37.69 35.56,37.06 C1.1 34.92,37.69 | 34.92,37.69 31.75,40.87 21.59,40.87 R23.2 | v42.57,35.75 36.2,29.76 36.2,28.17 D2.C | 34.92,37.69 v37.47,37.69
  Bottom 0.203: v42.57,35.75 39.97,37.8 v37.47,37.69
N$16
  Top 0.203: R15.1 75.88,16.74 71.44,16.74 LED1.1
N$19  (via drill 0.8)
  Top 0.203: 27.3,60.24 21.59,60.24 R28.2 | 27.3,60.24 27.94,60.87 C2.1 | v27.3,48.17 32.07,43.41 D3.C | 27.3,60.24 v27.3,59.28
  Bottom 0.203: v27.3,59.28 v27.3,48.17
PHASE_A
  Top 0.635: C3.2 21.27,15.47 16.83,19.91 13.97,19.91 TP24.TP 13.65,19.91 11.11,19.91 9.21,18.01 Q5.D 8.57,18.01 6.67,16.1 6.67,14.83 8.89,12.61 Q4.S 7.94,8.17 7.62,8.17 6.67,7.21 6.67,3.4 7.62,2.45 18.73,2.45 20.32,4.04 53.02,4.04 54.93,2.13 65.09,2.13 79.69,16.74 79.69,53.25 65.72,67.22 32.7,67.22 32.54,67.06 | 32.54,67.06 24.45,75.16 7.3,75.16 2.54,70.4 U$5.P$1 | 32.54,67.06 37.78,61.82 37.78,58.33 43.5,52.62 45.72,52.62 51.12,47.22 51.12,43.41 53.34,41.19 53.34,38.33 R4.2
PHASE_B
  Top 0.635: C1.2 33.02,37.06 34.61,35.47 36.83,35.47 39.69,38.33 39.69,40.23 40.64,41.19 42.86,41.19 44.45,39.6 R5.2 44.13,39.6 43.18,38.65 43.18,38.33 34.92,30.07 29.84,30.07 27.94,28.17 27.94,25.63 25.72,23.41 24.45,23.41 24.13,23.09 24.13,20.55 23.81,20.23 19.05,20.23 13.65,25.63 12.7,25.63 10.32,28.01 | TP25.TP 12.38,44.68 Q7.D 8.57,44.68 6.67,42.77 6.67,41.5 8.89,39.28 8.89,34.84 | U$6.P$1 2.54,37.38 4.76,35.15 4.76,30.71 7.62,27.85 10.16,27.85 10.32,28.01 | 10.32,28.01 11.11,28.8 11.11,32.61 8.89,34.84 | 8.89,34.84 Q6.S
PHASE_C
  Top 0.635: 27.94,63.73 21.91,63.73 17.78,59.6 13.65,59.6 TP26.TP 12.38,60.55 9.53,60.55 Q8.S 9.21,60.55 6.67,63.09 6.67,68.17 7.62,69.13 7.94,69.13 Q9.D | U$7.P$1 2.54,31.66 9.53,24.68 13.34,24.68 19.05,18.96 31.43,18.96 34.29,21.82 R6.2 34.61,21.82 37.78,24.99 37.83,28.94 46.09,37.2 46.04,40.87 44.77,42.14 42.86,42.14 39.69,45.31 35.88,45.31 29.84,51.35 29.84,61.82 27.94,63.73 | 27.94,63.73 C2.2
PWM
  Top 0.203: 59.05,13.88 58.42,13.25 R35.2 | 59.05,13.88 59.37,14.2 59.37,17.37 U1.12 | 59.05,13.88 61.28,11.66 65.41,11.66 69.85,16.1 69.85,17.37 70.48,18.01 77.15,18.01 78.11,18.96 78.11,26.26 77.47,26.9 76.2,26.9 74.61,28.49 74.61,30.07 75.25,30.71 75.56,30.71 76.52,31.66 U$14.P$1
PWM_AH  (via drill 0.8)
  Top 0.203: v53.42,26.31 56.83,26.26 U1.32 | v32.87,10.36 31.34,8.76 R18.1
  Bottom 0.203: v53.42,26.31 37.54,10.44 v32.87,10.36
PWM_AL  (via drill 0.8)
  Top 0.203: v48.63,23.1 50,24.63 55.24,24.68 U1.1 | v37.24,12.41 19.68,12.61 16.83,15.47 R21.1
  Bottom 0.203: v48.63,23.1 37.48,12.51 v37.24,12.41
PWM_BH  (via drill 0.8)
  Top 0.203: v51.98,23.24 55.24,23.72 U1.2 | v34.92,31.66 33.66,31.66 33.34,31.98 R24.1
  Bottom 0.203: v51.98,23.24 59.05,29.12 66.36,29.12 67.63,30.39 67.63,31.98 38.1,31.98 36.2,33.88 35.56,33.88 34.92,33.25 v34.92,31.66
PWM_BL  (via drill 0.8)
  Top 0.203: v56.19,11.29 55.56,11.66 55.56,14.83 56.83,16.1 56.83,17.37 U1.9 | v15.24,43.73 13.65,42.14 R26.1
  Bottom 0.203: v56.19,11.29 46.66,1.77 23.18,1.82 15.24,9.75 v15.24,43.73
PWM_CH  (via drill 0.8)
  Top 0.203: v58.42,15.15 58.42,17.37 U1.11 | v28.26,43.41 24.45,47.22 R29.1
  Bottom 0.203: v58.42,15.15 52.7,9.44 32.07,9.44 28.26,13.25 v28.26,43.41
PWM_CL  (via drill 0.8, 0.8 pad 0.55)
  Top 0.203: R31.1 20.95,67.54 | 20.95,67.54 TP3.TP | v54.9,16.78 56.52,18.64 61.28,18.64 61.59,18.33 61.59,17.69 U1.15 | 20.95,67.54 v20.95,68.81
  Bottom 0.203: v54.9,16.78 55.8,17.58 69.77,17.58 75.56,23.72 75.56,68.81 v20.95,68.81
RESET
  Top 0.203: TP4.TP 50.8,28.17 50.8,30.39 C5.1 | U1.29 59.37,26.26 59.37,26.9 58.42,27.85 50.8,27.85 TP4.TP | R12.1 46.99,28.17 50.48,28.17 TP4.TP
SCK
  Top 0.203: TP1.TP 65.72,18.01 65.09,18.01 64.14,18.96 U1.17
SCL  (via drill 0.8)
  Top 0.203: R14.1 75.88,23.09 75.88,23.72 73.98,25.63 v73.98,26.9 73.98,31.98 76.52,34.52 U$13.P$1 | v64.29,26.97 63.5,25.63 62.87,24.99 60.33,24.99 60.01,25.31 60.01,25.95 U1.28
  Bottom 0.203: v73.98,26.9 v64.29,26.97
SDA  (via drill 0.8)
  Top 0.203: U1.27 60.96,26.26 60.96,26.9 57.15,30.71 R13.1 56.83,30.71 v59.05,32.93 | v72.07,37.06 76.52,37.06 U$12.P$1
  Bottom 0.203: v72.07,37.06 69.53,34.52 60.64,34.52 v59.05,32.93
SENSE_A  (via drill 0.8)
  Top 0.203: 47.31,23.41 45.72,21.82 R1.2 | 47.31,23.41 49.21,25.31 56.2,25.31 57.78,23.72 63.82,23.72 U1.23 | TP12.TP 29.21,26.9 R7.2 29.53,26.9 v31.11,28.49 | v48.26,38.33 R4.1 | v46.86,23.71 47.31,23.41
  Bottom 0.203: v48.26,38.33 44.45,34.52 35.24,34.52 31.11,30.39 v31.11,28.49 31.11,26.26 33.85,23.71 v46.86,23.71
SENSE_B  (via drill 0.8)
  Top 0.203: 68.39,30.59 68.26,30.39 R2.2 | 68.39,30.59 66.6,27.53 65.84,25.11 U1.24 | TP13.TP 19.68,31.66 21.59,29.76 R8.2 21.59,29.44 25.4,33.25 35.56,33.25 | 35.56,33.25 40.64,38.33 40.64,38.65 41.59,39.6 R5.1 | v66.67,30.71 68.39,30.59 | 35.56,33.25 v35.88,32.93
  Bottom 0.203: v66.67,30.71 66.04,31.34 37.47,31.34 v35.88,32.93
SENSE_C  (via drill 0.8)
  Top 0.203: 26.04,21.82 27.62,20.23 TP14.TP | 26.04,21.82 R9.2 25.72,21.82 | 26.04,21.82 R6.1 32.05,22.15 v34.59,24.69 | 63.5,29.44 64.45,30.39 R3.2 | 63.5,29.44 62.55,28.49 62.55,26.26 U1.25 | v62.87,30.07 63.5,29.44
  Bottom 0.203: v62.87,30.07 62.55,29.76 39.69,29.76 v34.59,24.69
TEMP_ADC
  Top 0.203: TP7.TP R33.2 R20.1 69.85,38.33 69.85,29.44 69.53,29.12 68.58,29.12 67.63,28.17 67.63,25.95 64.77,23.09 64.14,23.09 U1.22
VBAT
  Top 0.635: Q8.D 9.21,57.38 10.48,58.65 TP11.TP 22.86,58.65 23.18,58.33 23.18,56.43 36.2,43.41 D3.A | Q6.D 7.94,32.93 7.62,32.93 5.71,34.84 5.71,54.52 8.57,57.38 Q8.D | 44.45,54.2 44.45,55.47 IC2.3 | 44.45,54.2 47.62,54.2 48.58,53.25 53.02,53.25 | 53.02,53.25 54.29,53.25 R10.2 | 44.45,54.2 IC2.4 | 46.99,36.74 46.99,34.84 40.32,28.17 D2.A 40.01,28.17 39.05,27.22 39.05,15.47 D1.A 38.73,15.47 36.83,13.56 21.91,13.56 18.41,17.06 15.56,17.06 15.24,16.74 15.24,11.66 10.16,6.58 Q4.D | 46.99,36.74 46.99,41.19 44.45,43.73 42.55,43.73 40.01,46.27 36.83,46.27 32.07,51.03 IC1.1 31.75,51.35 30.8,52.3 30.8,63.73 20.32,74.21 7.62,74.21 5.71,72.3 5.71,59.92 8.26,57.38 Q8.D | 53.02,53.25 53.02,42.77 54.93,40.87 54.93,37.06 54.61,36.74 46.99,36.74
VBAT+
  Top 0.635: 44.45,58.01 44.45,56.74 IC2.2 | U$1.P$1 44.45,62.78 | 44.45,62.78 44.45,58.01 | 44.45,58.01 IC2.1 | C17.1 54.61,65 52.39,62.78 44.45,62.78
VBAT_ADC
  Top 0.203: R10.1 64.14,55.47 | 64.14,55.47 TP8.TP 71.04,44.65 71.04,20.55 68.58,20.57 64.14,20.55 U1.19 | 64.14,55.47 R11.2
VCC5V  (via drill 0.8)
  Top 0.203: TP10.TP 53.34,21.5 54.29,20.55 55.24,20.55 U1.6 55.56,20.55 56.2,20.55 57.15,21.5 62.87,21.5 | TP10.TP 53.66,22.14 55.24,22.14 U1.4 | 62.87,21.5 63.82,21.5 U1.20 | R14.2 76.2,25.63 77.47,24.36 77.47,20.87 76.2,19.6 R15.2 75.88,19.6 75.56,19.91 64.14,19.91 U1.18 63.82,19.91 63.18,19.91 62.87,20.23 62.87,21.5 | 44.13,20.55 44.13,22.77 45.4,24.04 | 44.13,20.55 44.13,18.33 45.4,17.06 45.4,15.79 C9.1 | 45.4,24.04 46.67,25.31 R12.2 | 49.21,31.98 48.26,31.98 45.4,29.12 45.4,24.04 | 49.21,31.98 52.7,31.98 53.98,33.25 56.83,33.25 R13.2 | R20.2 58.42,39.6 53.34,34.52 49.53,34.52 49.21,34.2 49.21,31.98 | 44.13,20.55 46.67,20.55 47.62,21.5 53.02,21.5 TP10.TP | IC1.2 36.83,51.03 TP5.TP 40.64,48.49 41.91,47.22 C4.1 41.91,46.9 45.72,46.9 46.67,45.95 C7.1 46.99,45.95 v50.52,41.91
  Bottom 0.203: R20.2 v50.52,41.91
VCC5V-2
  Top 0.203: IC2.8 52.39,58.01 53.02,58.65 C10.1
(copper drawn outside any net)
  shapes: Bottom area x1

### Text on the board
Top: DarkESC | 60A | By - Yatin Khurana / ECE4M2018, 1604081064 | Simonk Firmware at Heart
tNames: DarkESC | 60A | By - Yatin Khurana / ECE4M2018, 1604081064 | Simonk Firmware at Heart